# EAGLE design stepper_fw_bw_w_nand (EAGLE 6.4)
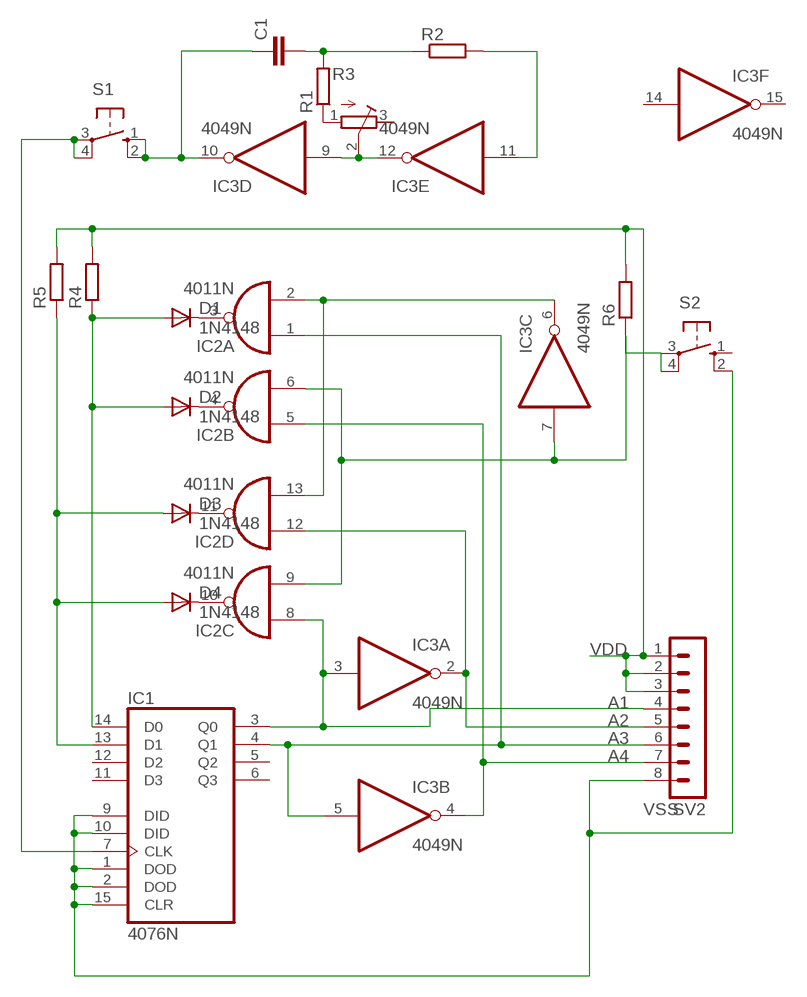
[diagram p0: schematic, sheet 1]

## Parts
C1  C-EU050-024X044  [C050-024X044]
D1  1N4148  1N4148DO35-7  [DO35-7]
D2  1N4148  1N4148DO35-7  [DO35-7]
D3  1N4148  1N4148DO35-7  [DO35-7]
D4  1N4148  1N4148DO35-7  [DO35-7]
IC1  4076N  [DIL16]
IC2  4011N  [DIL14]
IC3  4049N  [DIL16]
R1  R-EU_0207/10  [0207/10]
R2  R-EU_0207/10  [0207/10]
R3  R-TRIMM64W  [RTRIM64W]
R4  R-EU_0207/10  [0207/10]
R5  R-EU_0207/10  [0207/10]
R6  R-EU_0207/10  [0207/10]
S1  40-XX  [B3F-40XX]
S2  40-XX  [B3F-40XX]
SV2  MA08-1  [MA08-1]

## Nets
A1: IC1.3(Q0) IC2.8(C:I0) IC3.3(A:I) SV2.4
A2: IC2.12(D:I0) IC3.2(A:O) SV2.5
A3: IC1.4(Q1) IC2.1(A:I0) IC3.5(B:I) SV2.6
A4: IC2.5(B:I0) IC3.4(B:O) SV2.7
N$1: IC3.9(D:I) IC3.12(E:O) R3.2(S)
N$2: IC1.7(CLK) S1.3(P) S1.4(P1)
N$3: C1.2 R1.2 R2.1
N$4: IC3.11(E:I) R2.2
N$5: C1.1 IC3.10(D:O) S1.1(S) S1.2(S1)
N$6: R1.1 R3.1(A)
N$7: IC2.2(A:I1) IC2.13(D:I1) IC3.6(C:O)
N$8: IC2.6(B:I1) IC2.9(C:I1) IC3.7(C:I) R6.1 S2.3(P) S2.4(P1)
N$9: D1.C IC2.3(A:O)
N$10: D2.C IC2.4(B:O)
N$11: D3.C IC2.11(D:O)
N$12: D4.C IC2.10(C:O)
N$14: D3.A D4.A IC1.13(D1) R5.1
N$15: D1.A D2.A IC1.14(D0) R4.1
VDD: R4.2 R5.2 R6.2 SV2.1 SV2.2 SV2.3
VSS: IC1.1(DOD) IC1.2(DOD) IC1.9(DID) IC1.10(DID) IC1.15(CLR) S2.2(S1) SV2.8
Unconnected: IC1.5(Q2) IC1.6(Q3) IC1.11(D3) IC1.12(D2) IC3.14(F:I) IC3.15(F:O) R3.3(E) S2.1(S)

## Power pins joined to a net without a drawn wire
VDD: IC1.16(VDD) IC2.14(P:VDD) IC3.1(P:VDD)
VSS: IC1.8(VSS) IC2.7(P:VSS) IC3.8(P:VSS)

## Library data of the parts
C1 = rcl:C-EU: CAPACITOR, European symbol
D1-D4 = diode:1N4148: DIODE high speed (Philips)
IC1 = 40xx:4076: Quad D-type REGISTER
IC2 = 40xx:4011: Quad 2-input NAND
IC3 = 40xx:4049: Hex inverting BUFFER
R1 R2 R4-R6 = rcl:R-EU_: RESISTOR, European symbol
R3 = rcl:R-TRIMM: Trimm resistor
S1 S2 = switch-omron:40-XX: OMRON SWITCH; MF: OMRON COMPONENTS USA; MPN: B3F-4000; OC_FARNELL: 176434; OC_NEWARK: 36K3105
SV2 = con-lstb:MA08-1: PIN HEADER; OC_FARNELL: unknown; OC_NEWARK: unknown

## Board
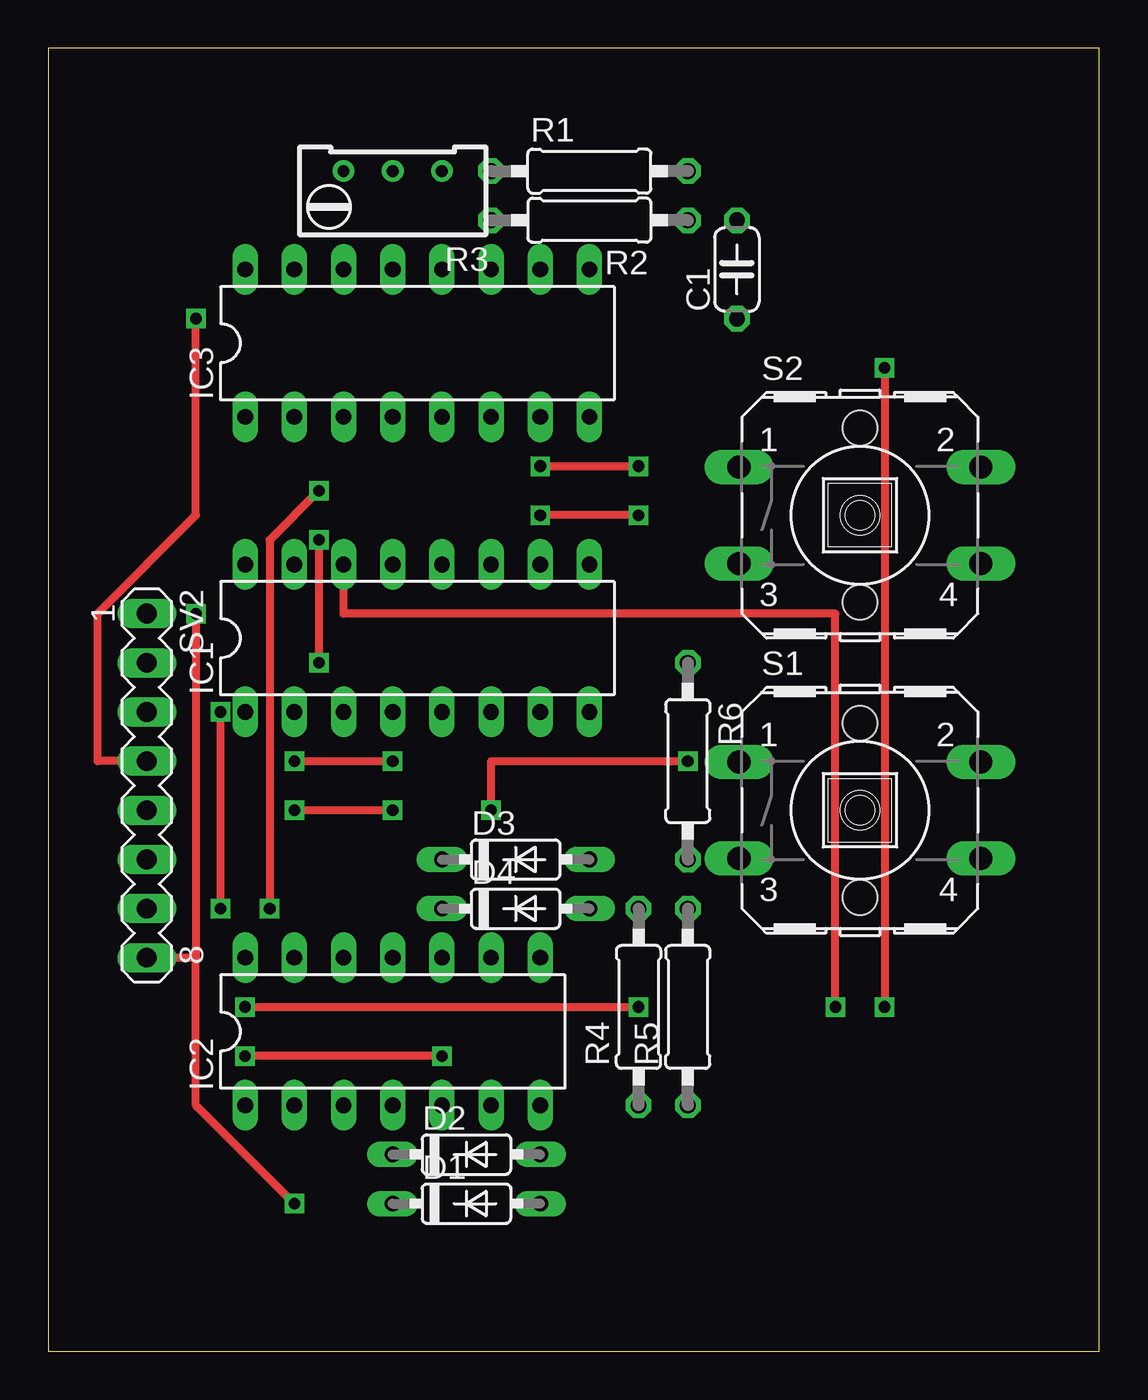
[diagram p1: board, top side]
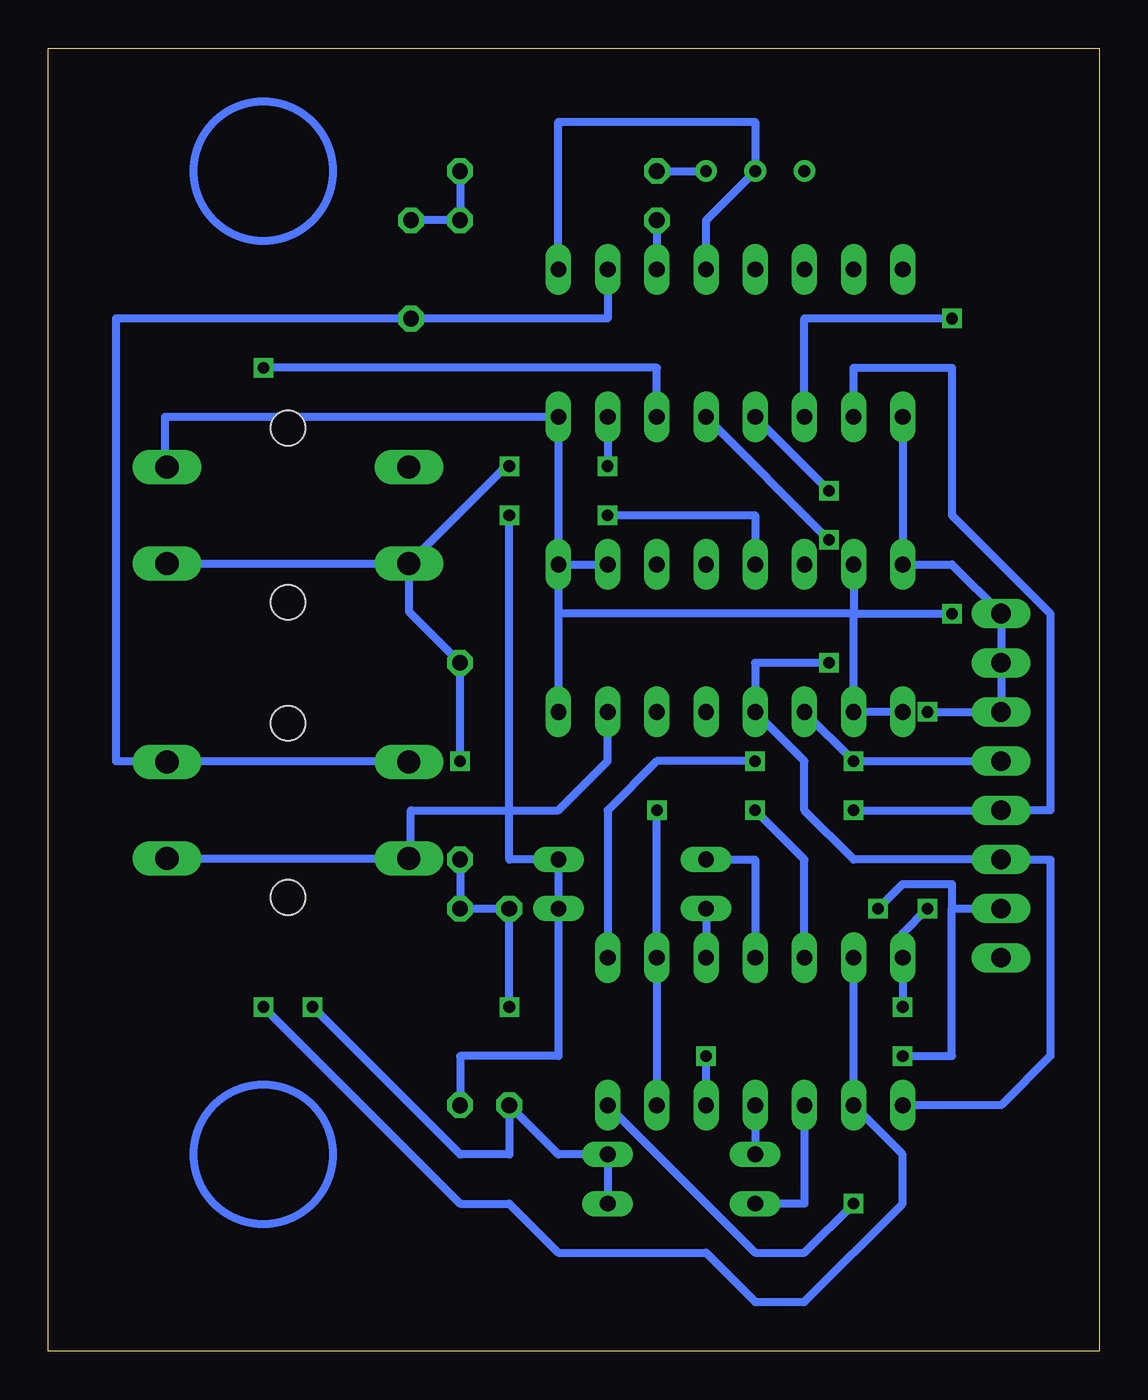
[diagram p2: board, bottom side, seen from below]

Size 54.28 x 67.3 mm. Coordinates in mm from the lower left corner, seen from the top.
Outline: 0,0 54.28,0 54.28,67.3 0,67.3 0,0
Copper layers (1*16): Top 0.035mm / dielectric 1.5mm / Bottom 0.035mm
Design rules "default": minimum track width 10mil, minimum drill 24mil, track to track 8mil, track to pad 8mil, pad to pad 8mil, via to via 8mil, smd to smd 8mil, copper to edge 40mil, drill to drill 8mil, minimum pad ring 10mil, minimum via ring 8mil, stop-mask expansion 4mil, vias tented up to drill 0mil, thermal gap 10mil

### Footprints (pad centres in the part's own frame; a part is rotated, then mirrored left to right if it is on the bottom)
C050-024X044 = drill 0.813 octagon: 1 -2.54,0; 2 2.54,0
DO35-7 = drill 0.813 long: A 3.81,0; C -3.81,0
DIL16 = drill 0.813 long: 1 -8.89,-3.81; 2 -6.35,-3.81; 3 -3.81,-3.81; 4 -1.27,-3.81; 5 1.27,-3.81; 6 3.81,-3.81; 7 6.35,-3.81; 8 8.89,-3.81; 9 8.89,3.81; 10 6.35,3.81; 11 3.81,3.81; 12 1.27,3.81; 13 -1.27,3.81; 14 -3.81,3.81; 15 -6.35,3.81; 16 -8.89,3.81
DIL14 = drill 0.813 long: 1 -7.62,-3.81; 2 -5.08,-3.81; 3 -2.54,-3.81; 4 0,-3.81; 5 2.54,-3.81; 6 5.08,-3.81; 7 7.62,-3.81; 8 7.62,3.81; 9 5.08,3.81; 10 2.54,3.81; 11 0,3.81; 12 -2.54,3.81; 13 -5.08,3.81; 14 -7.62,3.81
0207/10 = drill 0.813 octagon: 1 -5.08,0; 2 5.08,0
RTRIM64W = drill 0.61: 1 1.27,-2.54; 2 1.27,0; 3 1.27,2.54
B3F-40XX = drill 1.194 long: 1 -6.248,2.489; 2 6.248,2.489; 3 -6.248,-2.489; 4 6.248,-2.489 | hole 1.803: 0,-4.496; 0,4.496
MA08-1 = drill 1.016 long: 1 -8.89,0; 2 -6.35,0; 3 -3.81,0; 4 -1.27,0; 5 1.27,0; 6 3.81,0; 7 6.35,0; 8 8.89,0

### Placement (x,y rotation side)
C1  35.56,55.88 90 top
D1  21.59,7.62 0 top
D2  21.59,10.16 0 top
D3  24.13,25.4 0 top
D4  24.13,22.86 0 top
IC1  19.05,36.83 0 top
IC2  17.78,16.51 0 top
IC3  19.05,52.07 0 top
R1  27.94,60.96 0 top
R2  27.94,58.42 180 top
R3  17.78,59.69 90 top
R4  30.48,17.78 90 top
R5  33.02,17.78 90 top
R6  33.02,30.48 270 top
S1  41.91,27.94 0 top
S2  41.91,43.18 0 top
SV2  5.08,29.21 270 top

### Tracks (layer width: path | path; a pad name or v marks a point on that pad's centre or on a via)
A1  (via drill 0.6)
  Top 0.406: v12.7,30.48 v17.78,30.48 | SV2.4 2.54,30.48 2.54,38.1 7.62,43.18 v7.62,53.34
  Bottom 0.406: IC3.3 15.24,53.34 v7.62,53.34 | v17.78,30.48 22.86,30.48 25.4,27.94 IC2.8 | IC1.3 v12.7,30.48 SV2.4
  other vias: 5.08,30.48
A2  (via drill 0.6)
  Top 0.406: v17.78,27.94 v12.7,27.94
  Bottom 0.406: IC3.2 12.7,50.8 7.62,50.8 7.62,43.18 2.54,38.1 2.54,27.94 SV2.5 v12.7,27.94 | IC2.12 15.24,25.4 v17.78,27.94
A3  (via drill 0.6)
  Top 0.406: v13.97,41.91 v13.97,35.56
  Bottom 0.406: IC2.1 5.08,12.7 2.54,15.24 2.54,25.4 SV2.6 12.7,25.4 15.24,27.94 15.24,30.48 IC1.4 17.78,35.56 v13.97,35.56 | IC3.5 v13.97,41.91
A4  (via drill 0.6)
  Top 0.406: v20.32,15.24 v10.16,15.24 | v13.97,44.45 11.43,41.91 v11.43,22.86
  Bottom 0.406: IC2.5 v20.32,15.24 | v10.16,15.24 7.62,15.24 7.62,22.86 | 7.62,22.86 SV2.7 | IC3.4 v13.97,44.45 | v11.43,22.86 10.16,24.13 7.62,24.13 7.62,22.86
N$1
  Bottom 0.406: IC3.12 20.32,58.42 R3.2 17.78,63.5 27.94,63.5 IC3.9
N$2
  Bottom 0.406: S1.4 S1.3 35.51,25.45 35.56,25.4 35.56,27.94 27.94,27.94 25.4,30.48 IC1.7
N$3
  Bottom 0.406: R1.2 R2.1 C1.2
N$4
  Bottom 0.406: R2.2 IC3.11
N$5
  Bottom 0.406: IC3.10 25.4,53.34 C1.1 50.8,53.34 50.8,30.48 48.16,30.48 | 48.16,30.48 S1.2 | 48.16,30.48 35.66,30.48 S1.1
N$6
  Bottom 0.406: R1.1 R3.1
N$7  (via drill 0.6)
  Top 0.406: v43.18,50.8 v43.18,17.78
  Bottom 0.406: IC2.13 IC2.2 10.16,10.16 10.16,7.62 15.24,2.54 17.78,2.54 20.32,5.08 27.94,5.08 30.48,7.62 33.02,7.62 v43.18,17.78 | IC3.6 22.86,50.8 v43.18,50.8
N$8  (via drill 0.6)
  Top 0.406: v25.4,45.72 v30.48,45.72 | v22.86,27.94 22.86,30.48 v33.02,30.48
  Bottom 0.406: S2.4 S2.3 | IC3.7 v25.4,45.72 | v30.48,45.72 30.63,45.72 S2.3 | S2.3 35.66,38.2 R6.1 v33.02,30.48 | IC2.6 IC2.9 v22.86,27.94
N$9
  Bottom 0.406: IC2.3 15.24,7.62 D1.C
N$10
  Bottom 0.406: IC2.4 D2.C
N$11
  Bottom 0.406: D3.C 17.78,25.4 IC2.11
N$12
  Bottom 0.406: D4.C IC2.10
N$14  (via drill 0.6)
  Top 0.406: v30.48,43.18 v25.4,43.18
  Bottom 0.406: R5.1 33.02,15.24 27.94,15.24 D4.A D3.A 30.48,25.4 v30.48,43.18 | v25.4,43.18 17.78,43.18 IC1.13
N$15  (via drill 0.6)
  Top 0.406: v40.64,17.78 40.64,38.1 15.24,38.1 IC1.14
  Bottom 0.406: D1.A D2.A 27.94,10.16 R4.1 30.48,10.16 33.02,10.16 v40.64,17.78
VDD  (via drill 0.6)
  Top 0.406: v10.16,17.78 v30.48,17.78 | v8.89,22.86 v8.89,33.02
  Bottom 0.406: IC3.1 IC1.16 7.62,40.64 SV2.1 SV2.2 SV2.3 v8.89,33.02 | R6.2 R5.2 R4.2 v30.48,17.78 | v10.16,17.78 IC2.14 10.16,21.59 v8.89,22.86
VSS  (via drill 0.6)
  Top 0.406: v7.62,38.1 7.62,20.32 | 7.62,20.32 SV2.8 | v12.7,7.62 7.62,12.7 7.62,20.32
  Bottom 0.406: S2.2 48.16,45.72 48.26,45.72 48.26,48.26 IC3.8 IC1.9 | IC1.9 27.94,38.1 | 27.94,38.1 IC1.8 | IC1.15 12.7,38.1 | 12.7,38.1 27.94,38.1 | IC1.9 IC1.10 | IC1.1 IC1.2 12.7,38.1 | 12.7,38.1 v7.62,38.1 | IC2.7 17.78,5.08 15.24,5.08 v12.7,7.62
(copper drawn outside any net)
  shapes: Bottom circle x2